# Altium schematic sheet Sheet1.SchDoc
size A4
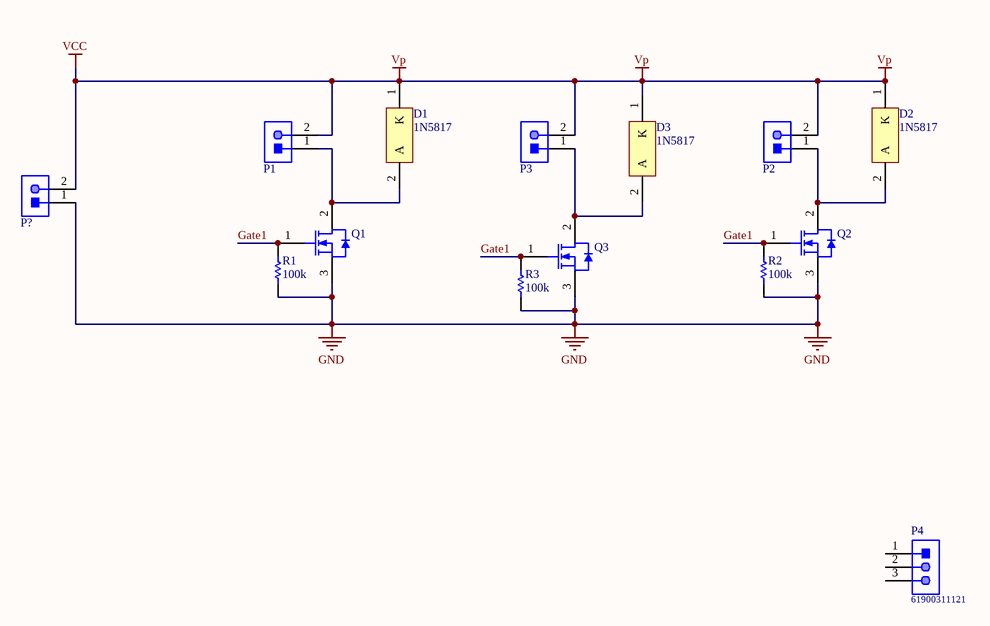
[diagram p0: Sheet1.SchDoc]

## Parts
D1  1N5817  [ONSC-AXIAL_LEAD-2-59-10_P]
D2  1N5817  [ONSC-AXIAL_LEAD-2-59-10_P]
D3  1N5817  [ONSC-AXIAL_LEAD-2-59-10_P]
P1  61900211121  [61900211121]  (value not drawn)
P2  61900211121  [61900211121]  (value not drawn)
P3  61900211121  [61900211121]  (value not drawn)
P4  61900311121  [61900311121]
P?  61900211121  [61900211121]  (value not drawn)
Q1  BUK7507-55B,127  [NXP-SOT78A]  (value not drawn)
Q2  BUK7507-55B,127  [NXP-SOT78A]  (value not drawn)
Q3  BUK7507-55B,127  [NXP-SOT78A]  (value not drawn)
R1  100k  [RESC1608X100X25ML20T15]
R2  100k  [RESC1608X100X25ML20T15]
R3  100k  [RESC1608X100X25ML20T15]

## Nets
GND: P?.1 Q1.3(S) Q2.3(S) Q3.3(S) R1.1 R2.1 R3.1
VCC: D1.1(K) D2.1(K) D3.1(K) P1.2 P2.2 P3.2 P?.2  [also labelled Vp]
Gate1: Q1.1(G) Q2.1(G) Q3.1(G) R1.2 R2.2 R3.2
NetD1_2: D1.2(A) P1.1 Q1.2(D)
NetD2_2: D2.2(A) P2.1 Q2.2(D)
NetD3_2: D3.2(A) P3.1 Q3.2(D)

Not connected (* = marked no-connect by the designer): P4 1 2 3

## Library data of the parts
D1-D3 = CMP-1055-00036-1: Rectifier, 2-Pin Axial_Lead, Pb-Free, Bulk Bag; Manufacturer: On Semiconductor; Configuration: Single; IFSM Max (A): 25; Note1: 0; ComponentLink3Description: Package Specification; ComponentLink1URL: http://www.onsemi.com/; ComponentLink2Description: Datasheet; ComponentLink1Description: Manufacturer URL; PackageVersion: Rev. U, 02/2005; DatasheetVersion: Rev. 10; PackageDescription: 2-Pin, Axial Lead, Diameter 2.35 mm; RoHS: TRUE; PackageReference: AXIAL_LEAD-2-59-10; ComponentLink3URL: http://www.onsemi.cn/pub_link/Collateral/59-10.PDF; ComponentLink2URL: http://www.onsemi.cn/pub_link/Collateral/1N5817-D.PDF; Packing: Bulk Bag; PartNumber: 1N5817; Mounting Technology: Through Hole
P1-P3 P? = CMP-1502-00584-1: Male Locking Header WR-WTB, THT, Vertical, pitch 2.54 mm, 1 x 2 position; Manufacturer: Wurth Elektronik; Position: 1x2; Contact Resistance: 20mOhm; Working Voltage: 250VAC; Pitch: 2.54mm; Gender: Male; Part Number: 61900211121; Mounting Technology: THT; Operating Temperature: -40to105degC; Orientation: Vertical; Packaging: Bag; Package Reference: 61900211121; Manufacturer URL: http://www.we-online.de; Datasheet URL: https://katalog.we-online.de/em/datasheet/6190xx11121.pdf; Publisher: WurthElektronik
P4 = CMP-1502-00585-1: Male Locking Header WR-WTB, THT, Vertical, pitch 2.54 mm, 1 x 3 position; Manufacturer: Wurth Elektronik; Contact Resistance: 20mOhm; Pitch: 2.54mm; Working Voltage: 250VAC; Position: 1x3; Mounting Technology: THT; Operating Temperature: -40to105degC; Part Number: 61900311121; Datasheet URL: https://katalog.we-online.de/em/datasheet/6190xx11121.pdf; Manufacturer URL: http://www.we-online.de; Publisher: WurthElektronik; Orientation: Vertical; Gender: Male; Package Reference: 61900311121; Packaging: Bag
Q1-Q3 = CMP-1259-00449-1: N-Channel TrenchMOS Standard Level FET, 55 V, 3-Pin SOT78A, Rail; Manufacturer: NXP Semiconductors; Automotive Qualified: Y; VGSth [typ] (V): 3; Qr [typ] (nC): 60; VDS [max] (V): 55; IDM [max] (A): 478; Channel Type: N; PartNumber: BUK7507-55B,127; Code_JEITA: SC-46; Packing: Rail; ComponentLink2URL: http://www.nxp.com/documents/data_sheet/BUK7507-55B.pdf; ComponentLink1Description: Manufacturer URL; ComponentLink3URL: http://www.nxp.com/documents/outline_drawing/sot078a_po.pdf; Mounting Technology: Through Hole; ComponentLink3Description: Package Specification; DatasheetVersion: Rev. 2; Code_JEDEC: 3-lead TO-220AB; PackageReference: SOT78A; ComponentLink1URL: http://www.nxp.com/; PackageDescription: 3-Pin Flange Mount, Vertical Straight Lead, Body 10 x 4.3 mm, Pitch 2.54 mm; PackageVersion: 05-03-14, 03/2005; ComponentLink2Description: Datasheet
R1-R3 = CMP-2000-03662-1: Manufacturer: Vishay Dale; Part Number: NTHS0603N01N1003JE